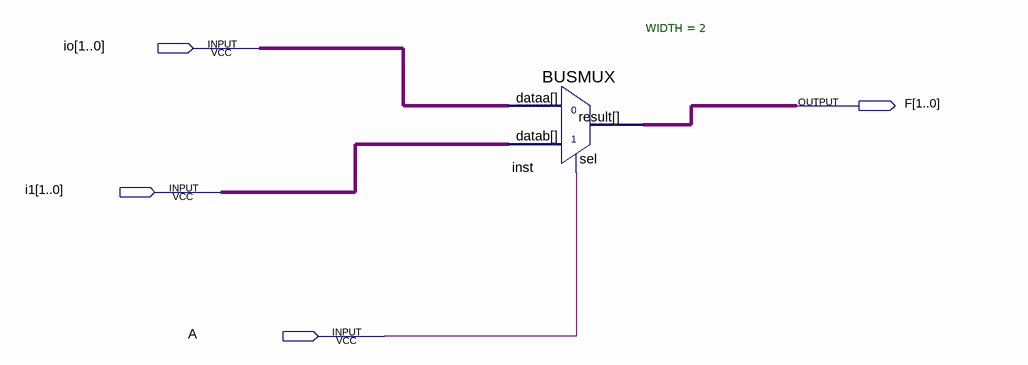
[diagram p0: schematic sheet]
// Quartus schematic lab8step1.bdf as structural Verilog: 1 symbols, 4 pins
module lab8step1 (
  input  [1:0] io,
  input  [1:0] i1,
  input  A,
  output [1:0] F
);

  BUSMUX #(.WIDTH(2)) inst (.datab(i1), .sel(A), .dataa(io), .result(F));
endmodule
